# EAGLE design mon (EAGLE 6.6.0)
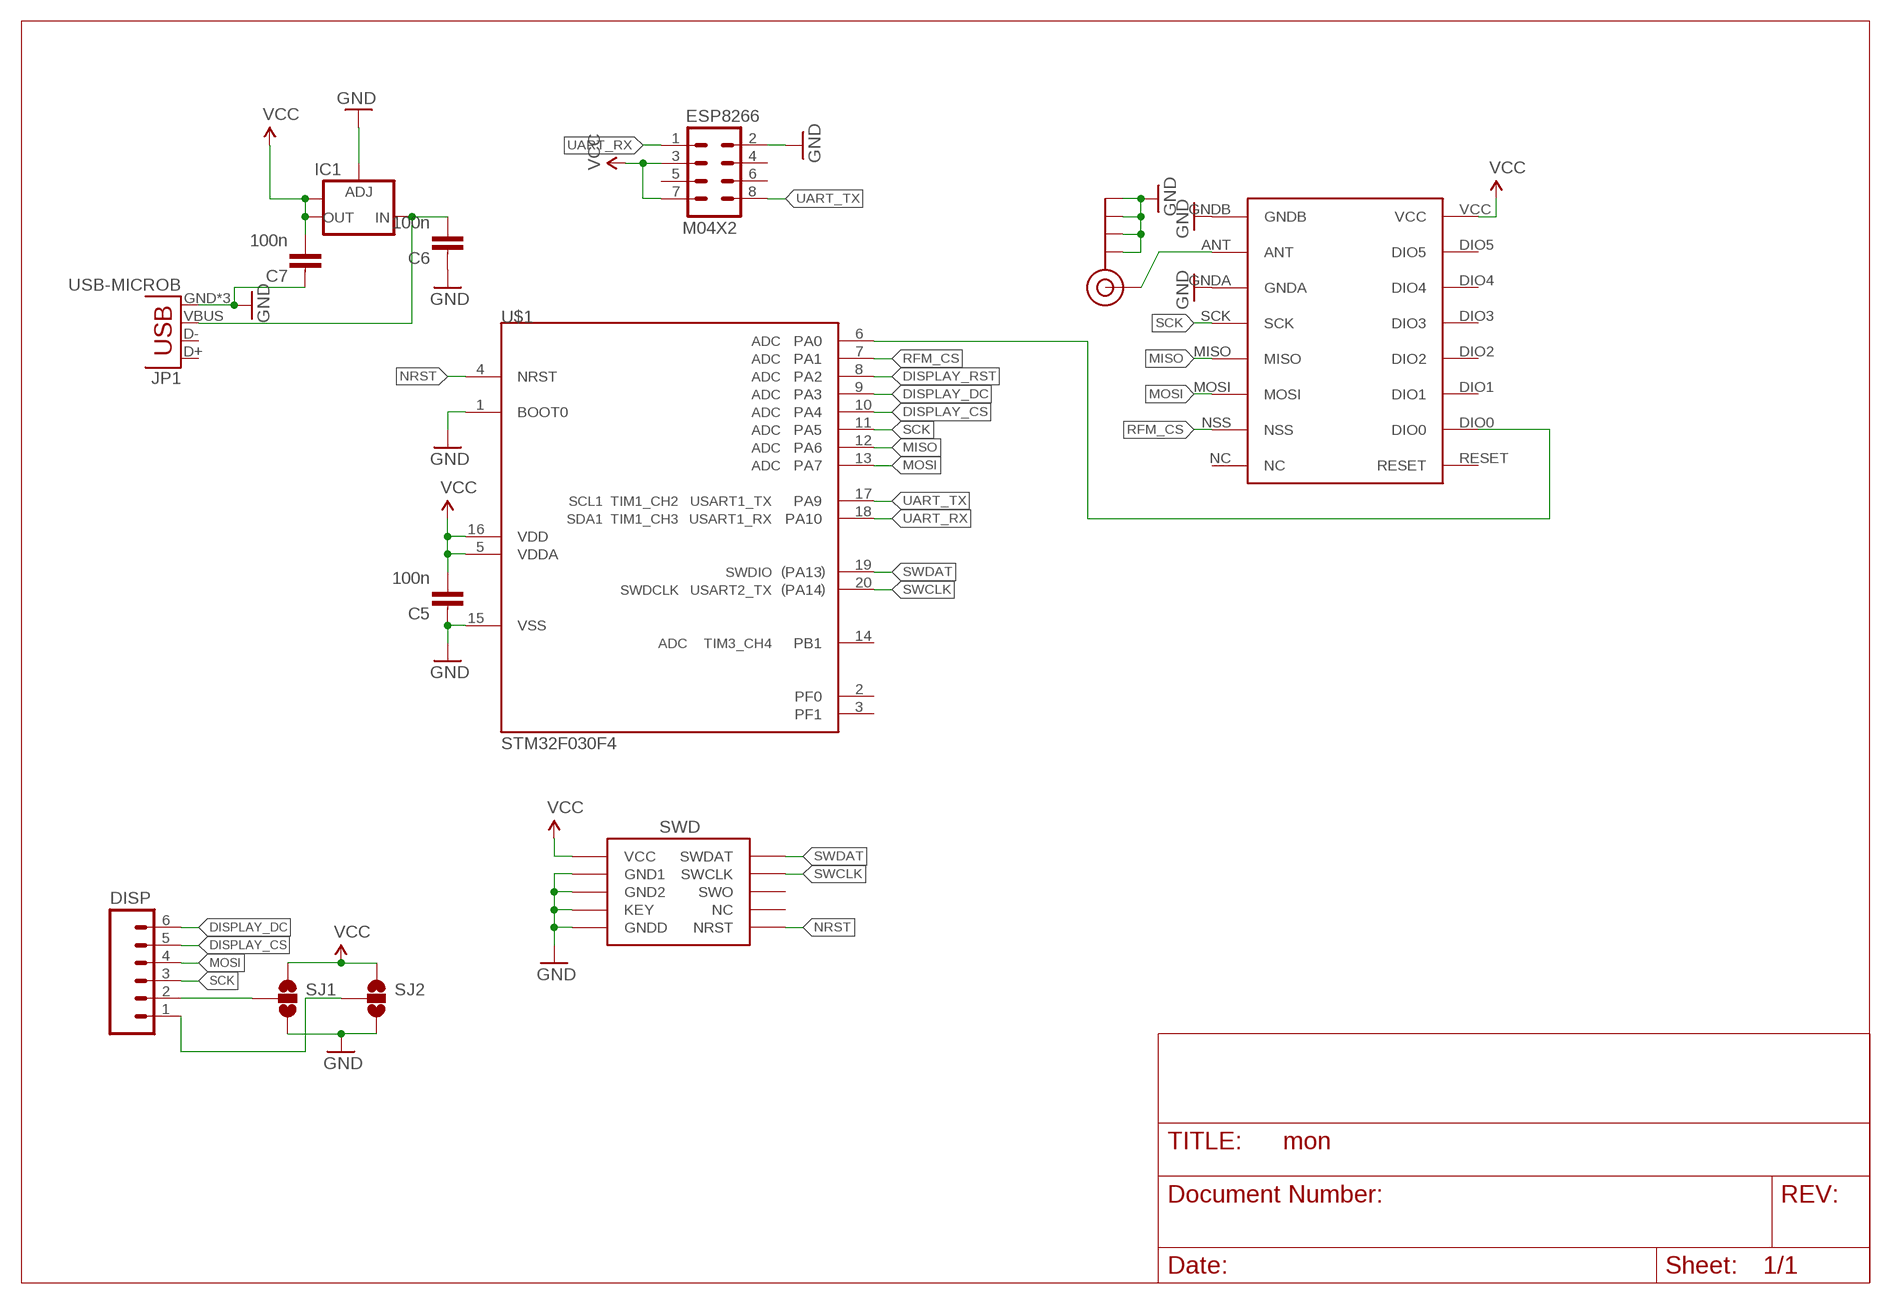
[diagram p0: schematic, sheet 1]

## Parts
C5  100n  CAPACITOR0603-L  [C0603-L]
C6  100n  CAPACITOR0603-L  [C0603-L]
C7  100n  CAPACITOR0603-L  [C0603-L]
DISP  M06SILK_FEMALE_PTH  [1X06]
ESP8266  M04X2  [2X4]
IC1  V_REG_LM1117SOT223  [SOT223]
J$1  SMA_EDGE  [SMA-EDGE]
JP1  USB-MICROB  [USB-MICROB]
SJ1  SOLDERJUMPER_2WAYS  [SJ_3]
SJ2  SOLDERJUMPER_2WAYS  [SJ_3]
U$1  STM32F030F4  [TSSOP20]
U$2  RFM69HW  [RFM]
U$4  SWD_SHROUD_SMD  [SWD_SMD_SHROUD]

## Nets
DISPLAY_CS: DISP.5 U$1.10(PA4)
DISPLAY_DC: DISP.6 U$1.9(PA3)
DISPLAY_RST: U$1.8(PA2)
GND: C5.1 C6.1 C7.1 ESP8266.2 IC1.1(ADJ) J$1.GND@0(GND) J$1.GND@1(GND) J$1.GND@2(GND) J$1.GND@3(GND) JP1.GND JP1.MT1(GND) JP1.MT2(GND) SJ1.3 SJ2.3 U$1.1(BOOT0) U$1.15(VSS) U$2.GNDA U$2.GNDB U$4.3(GND1) U$4.5(GND2) U$4.7(KEY) U$4.9(GNDD)
MISO: U$1.12(PA6) U$2.MISO
MOSI: DISP.4 U$1.13(PA7) U$2.MOSI
N$1: J$1.SIG(SIGNAL) U$2.ANT
N$2: C6.2 IC1.3(IN) JP1.VBUS
N$3: U$1.6(PA0) U$2.DIO0
N$4: DISP.2 SJ1.2
N$5: DISP.1 SJ2.2
NRST: U$1.4(NRST) U$4.10(NRST)
RFM_CS: U$1.7(PA1) U$2.NSS
SCK: DISP.3 U$1.11(PA5) U$2.SCK
SWCLK: U$1.20(PA14) U$4.4(SWCLK)
SWDAT: U$1.19(PA13) U$4.2(SWDAT)
UART_RX: ESP8266.1 U$1.18(PA10)
UART_TX: ESP8266.8 U$1.17(PA9)
VCC: C5.2 C7.2 ESP8266.3 ESP8266.7 IC1.2(OUT) IC1.4(OUT) SJ1.1 SJ2.1 U$1.5(VDDA) U$1.16(VDD) U$2.VCC U$4.1(VCC)
Unconnected: ESP8266.4 ESP8266.5 ESP8266.6 JP1.D+ JP1.D- U$1.2(PF0) U$1.3(PF1) U$1.14(PB1) U$2.DIO1 U$2.DIO2 U$2.DIO3 U$2.DIO4 U$2.DIO5 U$2.NC U$2.RESET U$4.6(SWO) U$4.8(NC)

## Library data of the parts
C5-C7 = passives-7351:CAPACITOR
DISP = SparkFun-Connectors:M06: Header 6 Standard 6-pin 0.1" header. Use with straight break away headers (SKU : PRT-00116), right angle break away headers (PRT-00553), swiss pins (PRT-00743), machine pins (PRT-00117), and female headers (PRT-00115). Molex polarized connector foot print use with SKU : PRT-08094 with associated crimp pins and housings. NOTES ON THE VARIANTS LOCK and LOCK_LONGPADS... This footprint was designed to help hold the alignment of a through-hole component (i.e. 6-pin header) while soldering it into place. You may notice that each hole has been shifted either up or down by 0.005 of an inch from it's more standard position (which is a perfectly straight line). This slight alteration caused the pins (the squares in the middle) to touch the edges of the holes. Because they are alternating, it causes a "brace" to hold the component in place. 0.005 has proven to be the perfect amount of "off-center" position when using our standard breakaway headers. Although looks a little odd when you look at the bare footprint, once you have a header in there, the alteration is very hard to notice. Also,if you push a header all the way into place, it is covered up entirely on the bottom side. This idea of altering the position of holes to aid alignment will be further integrated into the Sparkfun Library for other footprints. It can help hold any component with 3 or more connection pins.; PROD_ID: CONN-08437
ESP8266 = SparkFun-Connectors:M04X2: .1" header, two rows of four.
IC1 = SparkFun-PowerIC:V_REG_LM1117: Voltage Regulator LM1117 Standard adjustable voltage regulator but in SMD form. Spark Fun Electronics SKU : COM-00595; PROD_ID: VREG-08170
J$1 = jonsowman:SMA_EDGE: SMA Antenna Connector End launch SMA connector. The paste layer has been removed so that the connector can be hand soldered onto the board after reflow.
JP1 = SparkFun-Connectors:USB: USB Connectors USB-B-PTH is fully proven SKU : PRT-00139/CONN-08278 USB-miniB is fully proven SKU : PRT-00587 USB-A-PCB is untested. USB-A-H is throughly reviewed, but untested. Spark Fun Electronics SKU : PRT-00437 USB-B-SMT is throughly reviewed, but untested. Needs silkscreen touching up. USB-A-S has not been used/tested USB-MB-H has not been used/tested USB-MICROB has been used. CONN-09505; PROD_ID: CONN-09505
SJ1 SJ2 = SparkFun-Retired:SOLDERJUMPER_2WAY: Solder Jumper 2 way solder jumper
U$1 = dtb:STM32F030F4
U$2 = hoperf:RFM69HW
U$4 = dtb:SWD_SHROUD

## Board
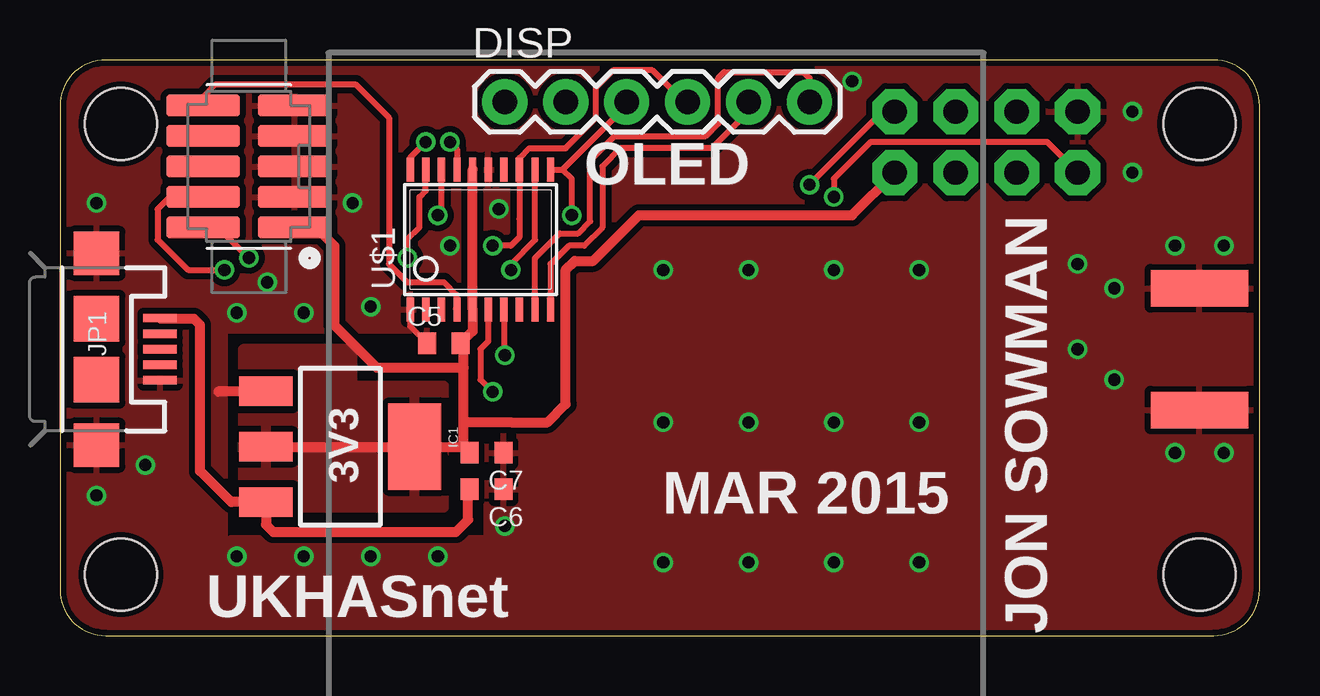
[diagram p1: board, top side]
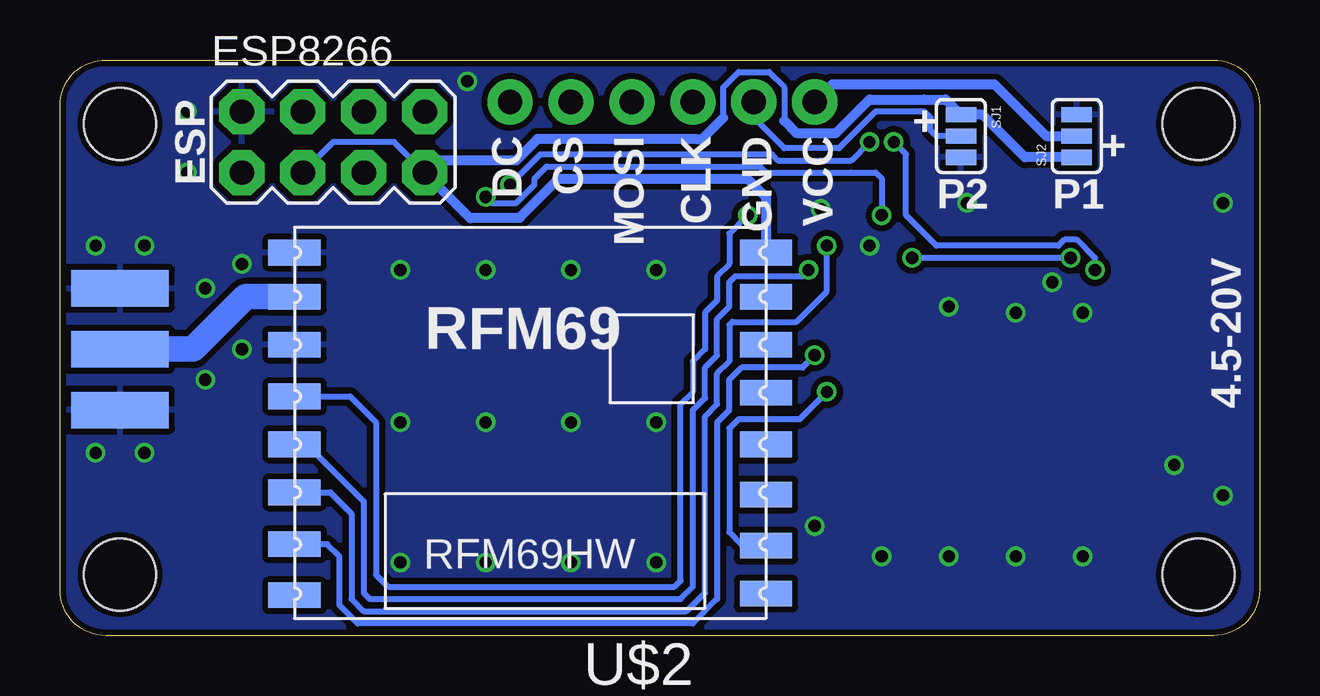
[diagram p2: board, bottom side, seen from below]

Size 50 x 24 mm. Coordinates in mm from the lower left corner, seen from the top.
Outline: 48.09,0 arc90 50,1.91 50,22.09 arc90 48.09,24 1.91,24 arc90 0,22.09 0,1.91 arc90 1.91,0 48.09,0
Copper layers (1*16): Top 0.035mm / dielectric 1.5mm / Bottom 0.035mm
Design rules "SeeedStudio_rule_no_angle_090911 *": minimum track width 6mil, minimum drill 12mil, track to track 6mil, track to pad 6mil, pad to pad 6mil, via to via 6mil, smd to smd 0mil, copper to edge 10mil, drill to drill 10mil, minimum pad ring 10mil, minimum via ring 6mil, stop-mask expansion 2mil, vias tented up to drill 100mil, thermal gap 10mil
Holes 3 mm at 2.54,2.54 47.5,2.54 47.5,21.34 2.54,21.34

### Footprints (pad centres in the part's own frame; a part is rotated, then mirrored left to right if it is on the bottom)
C0603-L = smd 0.75 x 0.9: 1 -0.7,0; 2 0.7,0
1X06 = drill 1.016 pad 1.88: 1 0,0; 2 2.54,0; 3 5.08,0; 4 7.62,0; 5 10.16,0; 6 12.7,0
2X4 = drill 1.016 pad 1.88 octagon: 1 -3.81,-1.27; 2 -3.81,1.27; 3 -1.27,-1.27; 4 -1.27,1.27; 5 1.27,-1.27; 6 1.27,1.27; 7 3.81,-1.27; 8 3.81,1.27
SOT223 = smd 1.219 x 2.235: 1 -2.311,-3.099; 2 0,-3.099; 3 2.311,-3.099 | smd 3.6 x 2.2: 4 0,3.099
SMA-EDGE = smd 1.524 x 4.064: GND@0 0,0; GND@1 5.08,0; SIG 2.54,0 | smd 1.524 x 4.064 bottom: GND@2 0,0; GND@3 5.08,0
USB-MICROB = smd 0.35 x 1.4: D+ 0,2.65; D- -0.65,2.65; GND 1.3,2.65; ID 0.65,2.65; VBUS -1.3,2.65 | smd 1.8 x 1.9: MT1 -4,0; MT2 4,0 | smd 1.9 x 1.9: P$1 -1.27,0; P$2 1.27,0
SJ_3 = smd 0.635 x 1.27: 1 -0.889,0; 2 0,0; 3 0.889,0
TSSOP20 = smd 0.305 x 0.991: 1 -2.925,-2.918; 2 -2.275,-2.918; 3 -1.625,-2.918; 4 -0.975,-2.918; 5 -0.325,-2.918; 6 0.325,-2.918; 7 0.975,-2.918; 8 1.625,-2.918; 9 2.275,-2.918; 10 2.925,-2.918; 11 2.925,2.918; 12 2.275,2.918; 13 1.625,2.918; 14 0.975,2.918; 15 0.325,2.918; 16 -0.325,2.918; 17 -0.975,2.918; 18 -1.625,2.918; 19 -2.275,2.918; 20 -2.925,2.918
RFM = smd 2.184 x 1.067: ANT 19.651,2.889; DIO0 0,13.27; DIO1 0,11.143; DIO2 0,9.047; DIO3 0,6.889; DIO4 0,4.889; DIO5 0,2.889; GNDA 19.651,4.889; GNDB 19.651,1.048; MISO 19.651,9.047; MOSI 19.651,11.047; NC 19.651,15.334; NSS 19.651,13.206; RESET 0,15.27; SCK 19.651,7.048; VCC 0,1.048
SWD_SMD_SHROUD = smd 0.914 x 3.048: 1 -2.54,-1.905; 2 -2.54,1.905; 3 -1.27,-1.905; 4 -1.27,1.905; 5 0,-1.905; 6 0,1.905; 7 1.27,-1.905; 8 1.27,1.905; 9 2.54,-1.905; 10 2.54,1.905

### Placement (x,y rotation side)
C5  16,12.19 0 top
C6  17.78,6.1 180 top
C7  17.78,7.62 180 top
DISP  18.54,22.25 0 top
ESP8266  38.61,20.57 0 bottom
IC1  11.68,7.87 270 top
J$1  47.5,9.4 90 bottom
JP1  1.52,11.94 270 top
SJ1  12.45,20.83 270 bottom
SJ2  7.62,20.83 90 bottom
U$1  17.53,16.51 0 top
U$2  20.57,17.02 180 bottom
U$4  7.87,19.56 90 top

### Tracks (layer width: path | path; a pad name or v marks a point on that pad's centre or on a via)
DISPLAY_CS
  Top 0.254: DISP.5 28.7,21.84 27.18,20.32 23.37,20.32 22.61,19.56 22.61,17.02 21.84,16.26 21.21,16.26 20.45,15.49 U$1.10
DISPLAY_DC
  Top 0.254: U$1.9 19.8,15.74 20.83,16.76 21.59,16.76 22.1,17.27 22.1,19.81 23.11,20.83 26.92,20.83 27.43,21.34 27.43,23.24 27.69,23.5 30.99,23.5 31.24,23.24 DISP.6
GND  (via drill 0.51)
  Top 0.254: U$1.1 14.6,12.89 C5.1
  Top 0.406: IC1.1 6.63,10.19 6.6,10.16
  other vias: 43.94,14.48 42.42,15.49 42.42,11.94 43.94,10.67 46.48,16.26 48.51,16.26 48.51,7.62 46.48,7.62 1.52,5.84 3.56,7.11 1.52,18.03 8.64,14.73 12.95,13.72 16.26,16.26 18.54,4.57 7.37,3.3 10.16,3.3 12.95,3.3 15.75,3.3 7.37,13.46 10.16,13.46 25.15,15.24 25.15,8.89 25.15,3.05 28.7,15.24 28.7,8.89 28.7,3.05 32.26,15.24 32.26,8.89 32.26,3.05 35.81,15.24 35.81,8.89 35.81,3.05 33.02,23.11 44.7,21.84 44.7,19.3 12.19,18.03 18.29,17.78
  pour Bottom (isolate 0.254): 0,23.88 0,0 50.04,0 50.04,23.88
  pour Top (isolate 0.254): 0,0 0,24.13 50.04,24.13 50.04,0 7.11,0 7.11,4.06 17.78,4.06 17.78,12.7 6.86,12.7 6.86,0
MISO  (via drill 0.51)
  Top 0.254: v18.8,15.24 18.8,15.49 19.81,16.51 19.81,19.42 U$1.12
  Bottom 0.254: U$2.MISO 39.72,7.97 37.34,5.59 37.34,1.78 37.08,1.52 24.13,1.52 23.62,2.03 23.62,9.4 23.11,9.91 23.11,11.18 22.61,11.68 22.61,13.21 22.1,13.72 22.1,14.73 21.84,14.99 19.05,14.99 v18.8,15.24
MOSI  (via drill 0.51)
  Top 0.254: DISP.4 26.01,22.25 24.69,23.57 23.06,23.57 22.35,22.86 22.35,21.59 21.08,20.32 19.56,20.32 19.15,19.91 U$1.13 19.15,17.37 19.15,16.61 18.8,16.26 v18.03,16.26
  Bottom 0.254: U$2.MOSI 38.74,5.97 37.85,5.08 37.85,1.52 37.34,1.02 23.88,1.02 23.11,1.78 23.11,9.14 22.61,9.65 22.61,10.92 22.1,11.43 22.1,12.95 21.97,13.08 19.3,13.08 18.03,14.35 v18.03,16.26
N$1
  Bottom 1.067: U$2.ANT 42.26,14.13 44.45,11.94 J$1.SIG
N$2
  Top 0.254: 4.2,13.21 JP1.VBUS
  Top 0.406: C6.2 17.02,6.03 17.02,4.83 16.51,4.32 8.89,4.32 8.59,4.62 IC1.3 7.14,5.56 5.84,6.86 5.84,12.95 5.59,13.21 4.2,13.21
N$3  (via drill 0.51)
  Top 0.254: U$1.6 17.85,12.26 17.53,11.94 17.53,10.67 v18.03,10.16
  Bottom 0.254: v18.03,10.16 19.18,9.02 21.72,9.02 22.1,8.64 22.1,4.32 21.59,3.81 20.64,3.81 U$2.DIO0
N$4
  Bottom 0.254: DISP.2 21.08,21.59 19.81,20.32 17.53,20.32 16,21.84 15.75,21.84 13.97,21.84 13.72,21.59 13.72,21.08 13.46,20.83 SJ1.2
N$5
  Bottom 0.406: DISP.1 17.81,22.99 11.05,22.99 9.14,21.08 8.89,20.83 SJ2.2
NRST
  Top 0.254: U$4.10 5.97,22.48 6.48,22.99 12.32,22.99 13.72,21.59 13.72,15.49 14.48,14.73 16,14.73 16.51,14.22 16.51,13.63 U$1.4
RFM_CS  (via drill 0.51)
  Top 0.254: U$1.7 18.5,11.72 v18.54,11.68
  Bottom 0.254: U$2.NSS 38.86,3.81 38.35,3.3 38.35,1.27 37.59,0.51 23.62,0.51 22.61,1.52 22.61,8.89 22.1,9.4 22.1,10.67 21.59,11.18 19.05,11.18 v18.54,11.68
SCK  (via drill 0.51)
  Top 0.254: U$1.11 20.95,19.43 | DISP.3 23.62,22.1 20.95,19.43 | v21.34,17.53 21.34,19.04 20.95,19.43
  Bottom 0.254: U$2.SCK 37.91,9.97 36.83,8.89 36.83,2.54 36.32,2.03 24.38,2.03 24.13,2.29 24.13,9.65 23.62,10.16 23.62,11.43 23.11,11.94 23.11,13.46 22.61,13.97 22.61,14.99 22.1,15.49 22.1,16.76 v21.34,17.53
SWCLK  (via drill 0.51)
  Top 0.254: U$4.4 4.57,18.29 4.06,17.78 4.06,16.51 5.33,15.24 v6.86,15.24 | U$1.20 14.6,19.93 v15.24,20.57
  Bottom 0.254: v6.86,15.24 6.86,15.75 7.62,16.51 8.13,16.51 8.38,16.26 13.46,16.26 14.73,17.53 14.73,20.07 v15.24,20.57
SWDAT  (via drill 0.51)
  Top 0.254: U$4.2 6.6,17.02 v7.87,15.75 | v14.48,15.75 14.48,16.51 14.99,17.02 14.99,18.29 15.24,18.54 15.24,19.42 U$1.19
  Bottom 0.254: v7.87,15.75 v14.48,15.75
UART_RX  (via drill 0.51)
  Top 0.254: ESP8266.1 41.15,20.57 33.78,20.57 32.26,19.05 v32.26,18.29 | v15.75,17.53 15.9,17.68 U$1.18
  Bottom 0.254: v32.26,18.29 32,18.03 30.99,18.03 30.23,18.8 30.23,19.05 29.72,19.56 20.83,19.56 20.57,19.3 17.02,19.3 16,19.3 15.75,19.05 v15.75,17.53
UART_TX  (via drill 0.51)
  Top 0.254: v16.26,20.57 16.55,20.28 U$1.17 | v31.24,18.8 34.29,21.84 ESP8266.8
  Bottom 0.254: v31.24,18.8 29.97,20.07 21.08,20.07 20.32,20.07 20.07,19.81 18.29,19.81 17.02,19.81 v16.26,20.57
VCC
  Top 0.254: 16.83,12.07 C5.2 | U$4.1 10.54,17.02
  Top 0.406: IC1.2 IC1.4 16.83,7.87 | 16.83,7.87 C7.2 | C5.2 17.2,12.69 U$1.5 U$1.16 | 16.83,7.87 16.83,8.89 | 16.83,8.89 16.83,11.18 | 16.83,11.18 16.83,12.07 | 10.54,17.02 10.67,17.02 11.43,16.26 11.43,12.95 13.21,11.18 16.83,11.18 | 16.83,8.89 17.27,8.89 18.8,8.89 20.32,8.89 21.08,9.65 21.08,15.24 21.46,15.62 22.23,15.62 24.13,17.53 32.77,17.53 33.02,17.53 ESP8266.7
  Bottom 0.254: ESP8266.7 36.07,20.57 38.61,20.57 ESP8266.3 | 22.35,21.59 22.35,22.86 21.72,23.5 20.45,23.5 19.81,22.86 19.81,21.46
  Bottom 0.406: 32.89,17.4 32.92,17.43 | 32.92,17.43 ESP8266.7 34.29,19.81 30.99,19.81 30.1,20.7 23.5,20.7 23.24,20.7 22.35,21.59 | 32.92,17.43 30.83,17.43 29.21,19.05 21.34,19.05 20.57,18.29 U$2.VCC | 19.81,21.46 19.3,20.95 17.65,20.95 16.26,22.35 13.97,22.35 13.08,22.35 SJ1.1 11.56,21.72 11.3,21.46 9.78,19.94 SJ2.1
  pour Top (isolate 0.305): 7.62,11.94 7.62,5.33 16,5.33 16,10.41 12.19,10.41 12.19,11.94

### Text on the board
tPlace: OLED | JON SOWMAN | MAR 2015 | 3V3 | UKHASnet
bPlace: ESP | + | VCC | GND | CLK | MOSI | CS | DC | + | P1 | P2 | 4.5-20V | RFM69